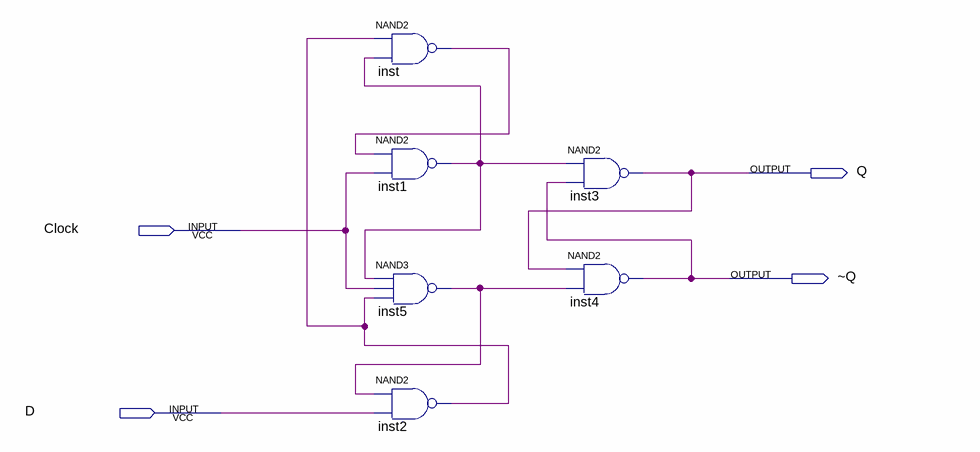
[diagram p0: schematic sheet]
// Quartus schematic lab9step3b.bdf as structural Verilog: 6 symbols, 4 pins
module lab9step3b (
  input  Clock,
  input  D,
  output Q,
  output \~Q 
);

  wire inst1_out, inst2_out, inst5_out, inst_out;

  nand inst (inst_out, inst2_out, inst1_out);
  nand inst1 (inst1_out, inst_out, Clock);
  nand inst5 (inst5_out, inst1_out, Clock, inst2_out);
  nand inst2 (inst2_out, inst5_out, D);
  nand inst3 (Q, inst1_out, \~Q );
  nand inst4 (\~Q , Q, inst5_out);
endmodule
